# Altium schematic sheet 2_HV_MUX.schdoc
size 711 x 327 mm; Name: A_A3; Symbol: A_A3; Device: A_A3; @Project Name: DM lite opensource board A2A V1.0; REV: 1.0; Date: 2022-03-15; Sheet: 1/1; Draw By: l87732382; Company: Your Company; Convert to PCB: yes; Add into BOM: yes
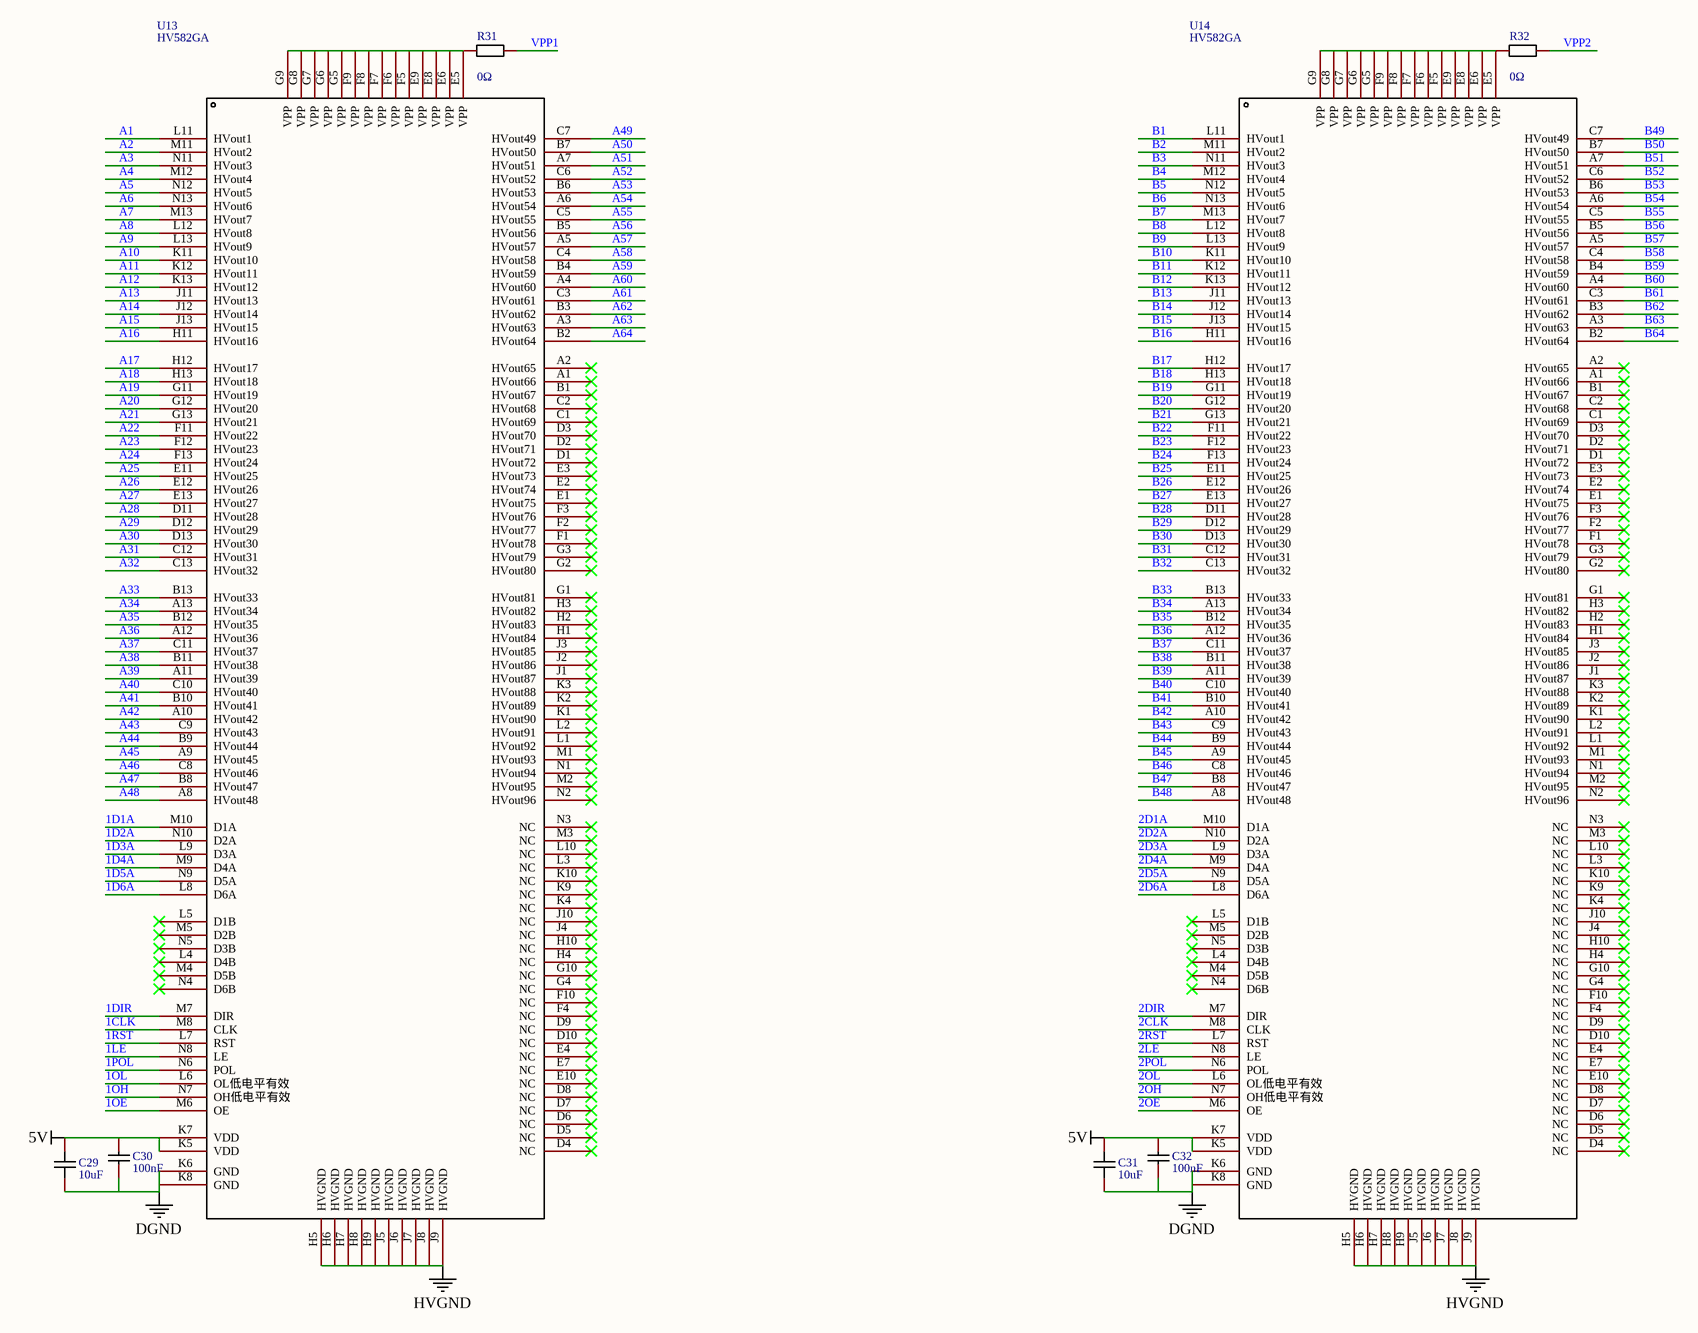
[diagram p0: 2_HV_MUX.schdoc]

## Parts
C29  10uF  [C0402]
C30  100nF  [C0402_NEW]
C31  10uF  [C0402]
C32  100nF  [C0402_NEW]
R31  value 0Ω  [R1206]  (hidden comment: 1206W4F0000T5E)
R32  value 0Ω  [R1206]  (hidden comment: 1206W4F0000T5E)
U13  HV582GA  [TFBGA-196 10*10*1.1]
U14  HV582GA  [TFBGA-196 10*10*1.1]

## Nets
5V: C29.2 C30.2 C31.2 C32.2 U13.K5(VDD) U13.K7(VDD) U14.K5(VDD) U14.K7(VDD)
DGND: C29.1 C30.1 C31.1 C32.1 U13.K6(GND) U13.K8(GND) U14.K6(GND) U14.K8(GND)
HVGND: U13.H5(HVGND) U13.H6(HVGND) U13.H7(HVGND) U13.H8(HVGND) U13.H9(HVGND) U13.J5(HVGND) U13.J6(HVGND) U13.J7(HVGND) U13.J8(HVGND) U13.J9(HVGND) U14.H5(HVGND) U14.H6(HVGND) U14.H7(HVGND) U14.H8(HVGND) U14.H9(HVGND) U14.J5(HVGND) U14.J6(HVGND) U14.J7(HVGND) U14.J8(HVGND) U14.J9(HVGND)
1CLK: U13.M8(CLK)
1D1A: U13.M10(D1A)
1D2A: U13.N10(D2A)
1D3A: U13.L9(D3A)
1D4A: U13.M9(D4A)
1D5A: U13.N9(D5A)
1D6A: U13.L8(D6A)
1DIR: U13.M7(DIR)
1LE: U13.N8(LE)
1OE: U13.M6(OE)
1OH: U13.N7(OH低电平有效)
1OL: U13.L6(OL低电平有效)
1POL: U13.N6(POL)
1RST: U13.L7(RST)
2CLK: U14.M8(CLK)
2D1A: U14.M10(D1A)
2D2A: U14.N10(D2A)
2D3A: U14.L9(D3A)
2D4A: U14.M9(D4A)
2D5A: U14.N9(D5A)
2D6A: U14.L8(D6A)
2DIR: U14.M7(DIR)
2LE: U14.N8(LE)
2OE: U14.M6(OE)
2OH: U14.N7(OH低电平有效)
2OL: U14.L6(OL低电平有效)
2POL: U14.N6(POL)
2RST: U14.L7(RST)
A1: U13.L11(HVout1)
A2: U13.M11(HVout2)
A3: U13.N11(HVout3)
A4: U13.M12(HVout4)
A5: U13.N12(HVout5)
A6: U13.N13(HVout6)
A7: U13.M13(HVout7)
A8: U13.L12(HVout8)
A9: U13.L13(HVout9)
A10: U13.K11(HVout10)
A11: U13.K12(HVout11)
A12: U13.K13(HVout12)
A13: U13.J11(HVout13)
A14: U13.J12(HVout14)
A15: U13.J13(HVout15)
A16: U13.H11(HVout16)
A17: U13.H12(HVout17)
A18: U13.H13(HVout18)
A19: U13.G11(HVout19)
A20: U13.G12(HVout20)
A21: U13.G13(HVout21)
A22: U13.F11(HVout22)
A23: U13.F12(HVout23)
A24: U13.F13(HVout24)
A25: U13.E11(HVout25)
A26: U13.E12(HVout26)
A27: U13.E13(HVout27)
A28: U13.D11(HVout28)
A29: U13.D12(HVout29)
A30: U13.D13(HVout30)
A31: U13.C12(HVout31)
A32: U13.C13(HVout32)
A33: U13.B13(HVout33)
A34: U13.A13(HVout34)
A35: U13.B12(HVout35)
A36: U13.A12(HVout36)
A37: U13.C11(HVout37)
A38: U13.B11(HVout38)
A39: U13.A11(HVout39)
A40: U13.C10(HVout40)
A41: U13.B10(HVout41)
A42: U13.A10(HVout42)
A43: U13.C9(HVout43)
A44: U13.B9(HVout44)
A45: U13.A9(HVout45)
A46: U13.C8(HVout46)
A47: U13.B8(HVout47)
A48: U13.A8(HVout48)
A49: U13.C7(HVout49)
A50: U13.B7(HVout50)
A51: U13.A7(HVout51)
A52: U13.C6(HVout52)
A53: U13.B6(HVout53)
A54: U13.A6(HVout54)
A55: U13.C5(HVout55)
A56: U13.B5(HVout56)
A57: U13.A5(HVout57)
A58: U13.C4(HVout58)
A59: U13.B4(HVout59)
A60: U13.A4(HVout60)
A61: U13.C3(HVout61)
A62: U13.B3(HVout62)
A63: U13.A3(HVout63)
A64: U13.B2(HVout64)
B1: U14.L11(HVout1)
B2: U14.M11(HVout2)
B3: U14.N11(HVout3)
B4: U14.M12(HVout4)
B5: U14.N12(HVout5)
B6: U14.N13(HVout6)
B7: U14.M13(HVout7)
B8: U14.L12(HVout8)
B9: U14.L13(HVout9)
B10: U14.K11(HVout10)
B11: U14.K12(HVout11)
B12: U14.K13(HVout12)
B13: U14.J11(HVout13)
B14: U14.J12(HVout14)
B15: U14.J13(HVout15)
B16: U14.H11(HVout16)
B17: U14.H12(HVout17)
B18: U14.H13(HVout18)
B19: U14.G11(HVout19)
B20: U14.G12(HVout20)
B21: U14.G13(HVout21)
B22: U14.F11(HVout22)
B23: U14.F12(HVout23)
B24: U14.F13(HVout24)
B25: U14.E11(HVout25)
B26: U14.E12(HVout26)
B27: U14.E13(HVout27)
B28: U14.D11(HVout28)
B29: U14.D12(HVout29)
B30: U14.D13(HVout30)
B31: U14.C12(HVout31)
B32: U14.C13(HVout32)
B33: U14.B13(HVout33)
B34: U14.A13(HVout34)
B35: U14.B12(HVout35)
B36: U14.A12(HVout36)
B37: U14.C11(HVout37)
B38: U14.B11(HVout38)
B39: U14.A11(HVout39)
B40: U14.C10(HVout40)
B41: U14.B10(HVout41)
B42: U14.A10(HVout42)
B43: U14.C9(HVout43)
B44: U14.B9(HVout44)
B45: U14.A9(HVout45)
B46: U14.C8(HVout46)
B47: U14.B8(HVout47)
B48: U14.A8(HVout48)
B49: U14.C7(HVout49)
B50: U14.B7(HVout50)
B51: U14.A7(HVout51)
B52: U14.C6(HVout52)
B53: U14.B6(HVout53)
B54: U14.A6(HVout54)
B55: U14.C5(HVout55)
B56: U14.B5(HVout56)
B57: U14.A5(HVout57)
B58: U14.C4(HVout58)
B59: U14.B4(HVout59)
B60: U14.A4(HVout60)
B61: U14.C3(HVout61)
B62: U14.B3(HVout62)
B63: U14.A3(HVout63)
B64: U14.B2(HVout64)
VPP1: R31.2
VPP2: R32.2
NetR31_1: R31.1 U13.E5(VPP) U13.E6(VPP) U13.E8(VPP) U13.E9(VPP) U13.F5(VPP) U13.F6(VPP) U13.F7(VPP) U13.F8(VPP) U13.F9(VPP) U13.G5(VPP) U13.G6(VPP) U13.G7(VPP) U13.G8(VPP) U13.G9(VPP)
NetR32_1: R32.1 U14.E5(VPP) U14.E6(VPP) U14.E8(VPP) U14.E9(VPP) U14.F5(VPP) U14.F6(VPP) U14.F7(VPP) U14.F8(VPP) U14.F9(VPP) U14.G5(VPP) U14.G6(VPP) U14.G7(VPP) U14.G8(VPP) U14.G9(VPP)

Not connected (* = marked no-connect by the designer): U13 A1(HVout66)* A2(HVout65)* B1(HVout67)* C1(HVout69)* C2(HVout68)* D1(HVout72)* D2(HVout71)* D3(HVout70)* D4(NC)* D5(NC)* D6(NC)* D7(NC)* D8(NC)* D9(NC)* D10(NC)* E1(HVout75)* E2(HVout74)* E3(HVout73)* E4(NC)* E7(NC)* E10(NC)* F1(HVout78)* F2(HVout77)* F3(HVout76)* F4(NC)* F10(NC)* G1(HVout81)* G2(HVout80)* G3(HVout79)* G4(NC)* G10(NC)* H1(HVout84)* H2(HVout83)* H3(HVout82)* H4(NC)* H10(NC)* J1(HVout87)* J2(HVout86)* J3(HVout85)* J4(NC)* J10(NC)* K1(HVout90)* K2(HVout89)* K3(HVout88)* K4(NC)* K9(NC)* K10(NC)* L1(HVout92)* L2(HVout91)* L3(NC)* L4(D4B)* L5(D1B)* L10(NC)* M1(HVout93)* M2(HVout95)* M3(NC)* M4(D5B)* M5(D2B)* N1(HVout94)* N2(HVout96)* N3(NC)* N4(D6B)* N5(D3B)*; U14 A1(HVout66)* A2(HVout65)* B1(HVout67)* C1(HVout69)* C2(HVout68)* D1(HVout72)* D2(HVout71)* D3(HVout70)* D4(NC)* D5(NC)* D6(NC)* D7(NC)* D8(NC)* D9(NC)* D10(NC)* E1(HVout75)* E2(HVout74)* E3(HVout73)* E4(NC)* E7(NC)* E10(NC)* F1(HVout78)* F2(HVout77)* F3(HVout76)* F4(NC)* F10(NC)* G1(HVout81)* G2(HVout80)* G3(HVout79)* G4(NC)* G10(NC)* H1(HVout84)* H2(HVout83)* H3(HVout82)* H4(NC)* H10(NC)* J1(HVout87)* J2(HVout86)* J3(HVout85)* J4(NC)* J10(NC)* K1(HVout90)* K2(HVout89)* K3(HVout88)* K4(NC)* K9(NC)* K10(NC)* L1(HVout92)* L2(HVout91)* L3(NC)* L4(D4B)* L5(D1B)* L10(NC)* M1(HVout93)* M2(HVout95)* M3(NC)* M4(D5B)* M5(D2B)* N1(HVout94)* N2(HVout96)* N3(NC)* N4(D6B)* N5(D3B)*

## Notes on the sheet
- 1
- 2
- 3
- 4
- 5
- 6
- 7
- 8
- A
- B
- C
- D
- E
- TITLE:
- DM lite opensource board A2A V1.0
- REV:
- 1.0
- Date:
- Company:
- 2022-03-15
- Your Company
- Drawn By:
- l87732382
- Sheet:
- 1/1

## Library data of the parts
C29 C31 = CL05A106MP5NUNC: Manufacturer: Samsung Electro-Mechanics; Convert to PCB: yes; Name: 10uF; Symbol: 10uF; Device: CL05A106MP5NUNC; Supplier: LCSC; Supplier Part: C315248; Manufacturer Part: CL05A106MP5NUNC; JLCPCB Part Class: Extended Part; Add into BOM: yes; Origin Footprint: C0402
C30 C32 = CL05B104KO5NNNC: Manufacturer: SAMSUNG; Convert to PCB: yes; Name: 100nF; Symbol: 100nF; Device: CL05B104KO5NNNC; Supplier: LCSC; Manufacturer Part: CL05B104KO5NNNC; Supplier Part: C1525; JLCPCB Part Class: Basic Part; Add into BOM: yes; Origin Footprint: C0402_NEW
R31 R32 = 1206W4F0000T5E: 电阻类型:厚膜电阻;阻值:0Ω;精度:±1%;功率:250mW;温度系数:±800ppm/℃;最大工作电压:200V;工作温度范围:-55℃~+155℃;; Manufacturer: UNI-ROYAL(厚声); Add into BOM: yes; Tolerance: ±1%; Power(Watts): 250mW; Overload Voltage (Max): 200V; Name: 0Ω; Symbol: 1206W4F0000T5E; Device: 1206W4F0000T5E; LCSC Part Name: 0Ω ±1% 250mW; Supplier Part: C17888; Manufacturer Part: 1206W4F0000T5E; Supplier Footprint: 1206; JLCPCB Part Class: 基础库; Supplier: LCSC; Convert to PCB: yes; Type: 厚膜电阻; Temperature Coefficient: ±800ppm/℃; Operating Temperature Range: -55℃~+155℃
U13 U14 = HV582GA: Manufacturer: Microchip; Convert to PCB: yes; Name: HV582GA; Symbol: HV582GA; Device: HV582GA; Add into BOM: yes; Origin Footprint: TFBGA-196 10*10*1.1